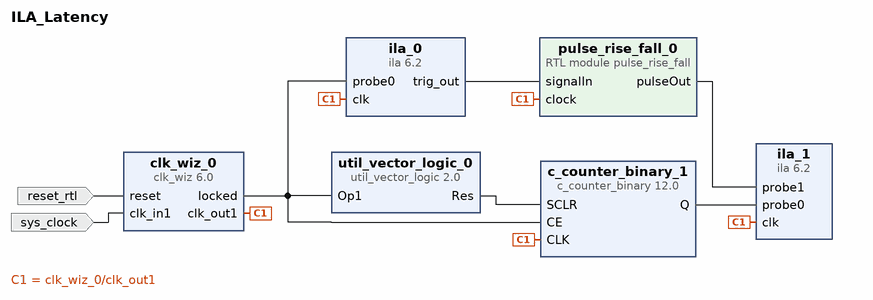
[diagram p0: block diagram of the top level]
# Vivado block design ILA_Latency, xc7z010clg400-1, Vivado 2018.2
create_bd_design ILA_Latency

create_bd_port -dir I -type rst reset_rtl
set_property -dict {CONFIG.POLARITY ACTIVE_HIGH} [get_bd_ports reset_rtl]
create_bd_port -dir I -type clk sys_clock
set_property -dict {CONFIG.FREQ_HZ 125000000 CONFIG.PHASE 0.000} [get_bd_ports sys_clock]

create_bd_cell -type ip -vlnv xilinx.com:ip:ila:6.2 ila_0
set_property -dict [list \
  CONFIG.C_PROBE0_WIDTH 1 \
  CONFIG.C_DATA_DEPTH 1024 \
  CONFIG.C_NUM_OF_PROBES 1 \
  CONFIG.C_TRIGOUT_EN true \
  CONFIG.C_EN_STRG_QUAL 1 \
  CONFIG.C_PROBE1_MU_CNT 2 \
  CONFIG.C_PROBE0_MU_CNT 2 \
  CONFIG.C_TRIGIN_EN false \
  CONFIG.ALL_PROBE_SAME_MU_CNT 2 \
  CONFIG.C_ENABLE_ILA_AXI_MON false \
  CONFIG.C_MONITOR_TYPE Native \
] [get_bd_cells ila_0]
create_bd_cell -type ip -vlnv xilinx.com:ip:c_counter_binary:12.0 c_counter_binary_1
set_property -dict {CONFIG.Output_Width 32 CONFIG.CE true CONFIG.SCLR true} [get_bd_cells c_counter_binary_1]
create_bd_cell -type ip -vlnv xilinx.com:ip:ila:6.2 ila_1
set_property -dict [list \
  CONFIG.C_PROBE1_WIDTH 1 \
  CONFIG.C_PROBE0_WIDTH 32 \
  CONFIG.C_NUM_OF_PROBES 2 \
  CONFIG.C_EN_STRG_QUAL 1 \
  CONFIG.C_PROBE1_MU_CNT 2 \
  CONFIG.C_PROBE0_MU_CNT 2 \
  CONFIG.ALL_PROBE_SAME_MU_CNT 2 \
  CONFIG.C_ENABLE_ILA_AXI_MON false \
  CONFIG.C_MONITOR_TYPE Native \
] [get_bd_cells ila_1]
create_bd_cell -type ip -vlnv xilinx.com:ip:util_vector_logic:2.0 util_vector_logic_0
set_property -dict {CONFIG.C_SIZE 1 CONFIG.C_OPERATION not} [get_bd_cells util_vector_logic_0]
create_bd_cell -type ip -vlnv xilinx.com:ip:clk_wiz:6.0 clk_wiz_0
set_property -dict [list \
  CONFIG.CLKIN1_JITTER_PS 80.0 \
  CONFIG.CLKOUT1_REQUESTED_OUT_FREQ 100 \
  CONFIG.MMCM_DIVCLK_DIVIDE 1 \
  CONFIG.MMCM_CLKFBOUT_MULT_F 8.000 \
  CONFIG.MMCM_CLKIN1_PERIOD 8.000 \
  CONFIG.MMCM_CLKIN2_PERIOD 10.000 \
  CONFIG.MMCM_CLKOUT0_DIVIDE_F 10.000 \
  CONFIG.USE_BOARD_FLOW true \
  CONFIG.CLK_IN1_BOARD_INTERFACE sys_clock \
  CONFIG.CLKOUT1_JITTER 124.615 \
  CONFIG.CLKOUT1_PHASE_ERROR 96.948 \
] [get_bd_cells clk_wiz_0]
create_bd_cell -type module -reference pulse_rise_fall pulse_rise_fall_0

# ---- connections ----

connect_bd_net [get_bd_ports reset_rtl] [get_bd_pins clk_wiz_0/reset]
connect_bd_net [get_bd_ports sys_clock] [get_bd_pins clk_wiz_0/clk_in1]
connect_bd_net [get_bd_pins clk_wiz_0/locked] [get_bd_pins c_counter_binary_1/CE] [get_bd_pins util_vector_logic_0/Op1] [get_bd_pins ila_0/probe0]
connect_bd_net [get_bd_pins util_vector_logic_0/Res] [get_bd_pins c_counter_binary_1/SCLR]
connect_bd_net [get_bd_pins clk_wiz_0/clk_out1] \
  [get_bd_pins c_counter_binary_1/CLK] [get_bd_pins ila_1/clk] [get_bd_pins ila_0/clk] [get_bd_pins pulse_rise_fall_0/clock]
connect_bd_net [get_bd_pins c_counter_binary_1/Q] [get_bd_pins ila_1/probe0]
connect_bd_net [get_bd_pins ila_0/trig_out] [get_bd_pins pulse_rise_fall_0/signalIn]
connect_bd_net [get_bd_pins pulse_rise_fall_0/pulseOut] [get_bd_pins ila_1/probe1]

validate_bd_design
save_bd_design
